# Altium schematic sheet Main_In.SchDoc
size A4
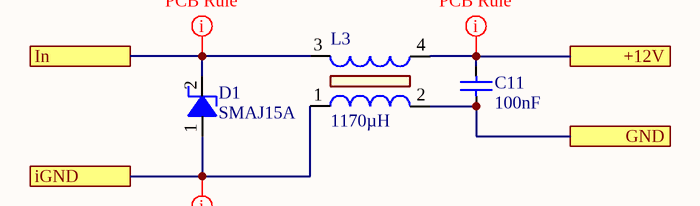
[diagram p0: Main_In.SchDoc]

## Parts
C11  100nF  [C0603V]
D1  SMAJ15A  [DO-214AC]
L3  1170µH  [Polecat]

## Ports
+12V, GND, iGND, In

## Nets
+12V: C11.2 L3.4 ; port +12V
GND: C11.1 L3.2 ; port GND
iGND: D1.1(ANODE) L3.1 ; port iGND
In: D1.2(CATHODE) L3.3 ; port In

## Layout directives
rule Clearance Constraint [Clearance = 0.5mm]; rule Width Constraint [Pref Width = 2mm    Min Width = 0.5mm    Max Width = 2mm]: +12V
rule Clearance Constraint [Clearance = 1mm]; rule Width Constraint [Pref Width = 2mm    Min Width = 0.5mm    Max Width = 2mm]: iGND, In

## Library data of the parts
C11 = C0000005: MLCC, 0.1uF 16V 10% X7R 0603; Manufacturer: KEMET; Manufacturer Part Number: C0603C104K4RACTU; Voltage: 16; Project: AUT-RX03-00; Note: 0,041 €; Part Number: C0000005; Part Type: MLCC; Tolerance: 10%; Material: X7R; Package: 0603 (1608 metric); SMD: Yes; Supplier 1: Farnell; Supplier Part Number 1: 1414610RL; Supplier 2: Mouser; Supplier Part Number 2: 80-C0603C104K4R; ComponentLink1Description: MFG link; ComponentLink1URL: http://www.kemet.com/datasheets&C0603C104K4RACTU; Data: 2011.02.27
D1 = D0000004: DIODE, TVS, 15V, 400W; Manufacturer: MULTICOMP; Current: 16.4A; Part Number: D0000004; Part Type: Diode\TVS\Unidir; Vforvard: 15V; Rating: 400W; SMD: Yes; Manufacturer Part Number: SMAJ15A; Price: 0,71; MOQ: 1; ComponentLink1Description: MFG link; ComponentLink1URL: http://www.farnell.com/datasheets/574664.pdf; ComponentLink2Description: DataSheet; Qty: 5; Data: 2011.02.17; Supplier 1: Farnell; Supplier Part Number 1: 1578958
L3 = L0000055: INDUCTOR COM MODE 1.17MH SMD; Manufacturer: PULSE Electronics; Manufacturer Part Number: P0354NL; Resistance: 0.2 ohm; Current: 1.22A; Part Number: L0000055; Part Type: Inductor\Common Mode; SMD: Yes; Supplier 1: Mouser; Supplier Part Number 1: 673-P0354NL; ComponentLink1Description: MFG link; ComponentLink1URL: http://ww2.pulseeng.com/products/datasheets/SPM2007_63.pdf; ComponentLink2Description: DataSheet; Qty: 2; Data: 2011.11.15